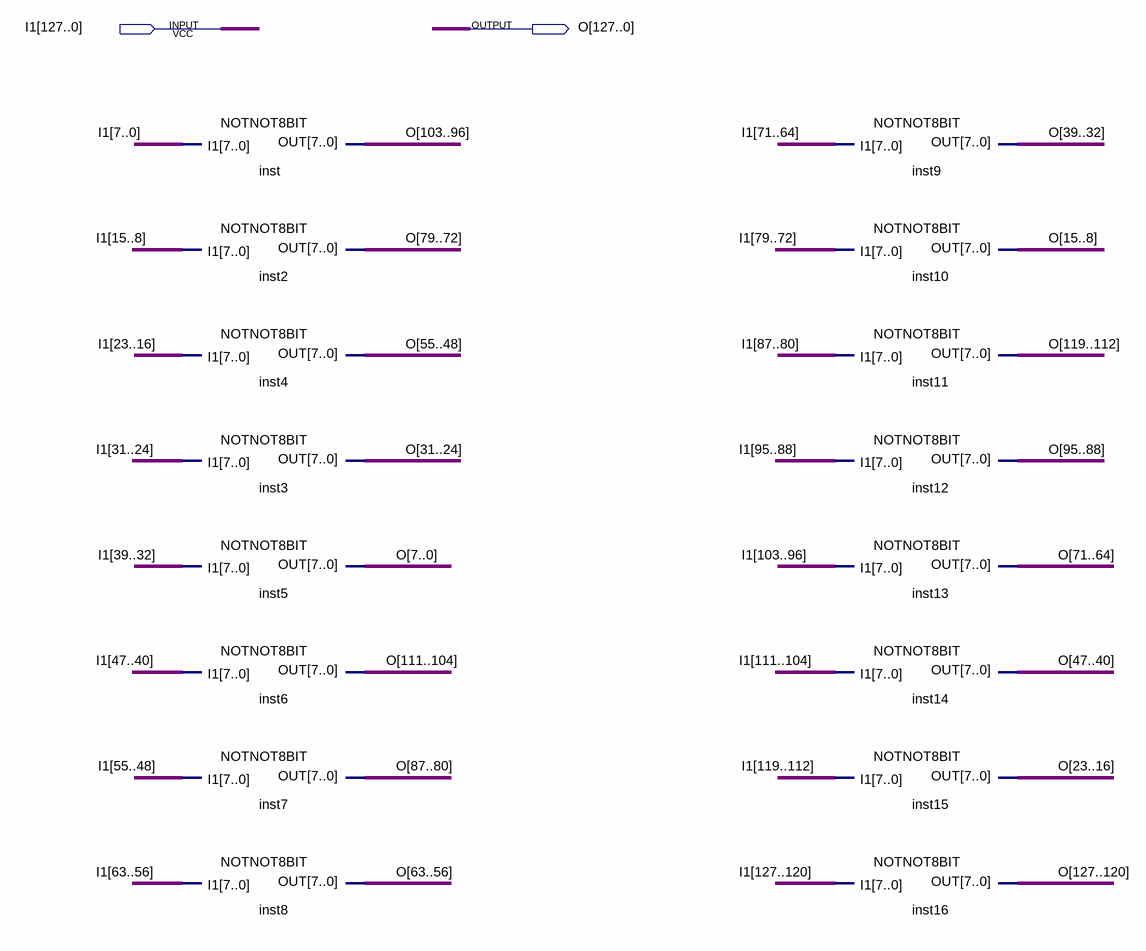
[diagram p0: schematic sheet]
// Quartus schematic SHIFTROW.bdf as structural Verilog: 16 symbols, 2 pins
module SHIFTROW (
  input  [127:0] I1,
  output [127:0] O
);

  NOTNOT8BIT inst (.I1(I1[7:0]), .OUT(O[103:96]));
  NOTNOT8BIT inst2 (.I1(I1[15:8]), .OUT(O[79:72]));
  NOTNOT8BIT inst4 (.I1(I1[23:16]), .OUT(O[55:48]));
  NOTNOT8BIT inst3 (.I1(I1[31:24]), .OUT(O[31:24]));
  NOTNOT8BIT inst5 (.I1(I1[39:32]), .OUT(O[7:0]));
  NOTNOT8BIT inst6 (.I1(I1[47:40]), .OUT(O[111:104]));
  NOTNOT8BIT inst7 (.I1(I1[55:48]), .OUT(O[87:80]));
  NOTNOT8BIT inst8 (.I1(I1[63:56]), .OUT(O[63:56]));
  NOTNOT8BIT inst9 (.I1(I1[71:64]), .OUT(O[39:32]));
  NOTNOT8BIT inst10 (.I1(I1[79:72]), .OUT(O[15:8]));
  NOTNOT8BIT inst11 (.I1(I1[87:80]), .OUT(O[119:112]));
  NOTNOT8BIT inst12 (.I1(I1[95:88]), .OUT(O[95:88]));
  NOTNOT8BIT inst13 (.I1(I1[103:96]), .OUT(O[71:64]));
  NOTNOT8BIT inst14 (.I1(I1[111:104]), .OUT(O[47:40]));
  NOTNOT8BIT inst15 (.I1(I1[119:112]), .OUT(O[23:16]));
  NOTNOT8BIT inst16 (.I1(I1[127:120]), .OUT(O[127:120]));
endmodule
